# EAGLE schematic PCB-SCH mvs (EAGLE 7.6.0)
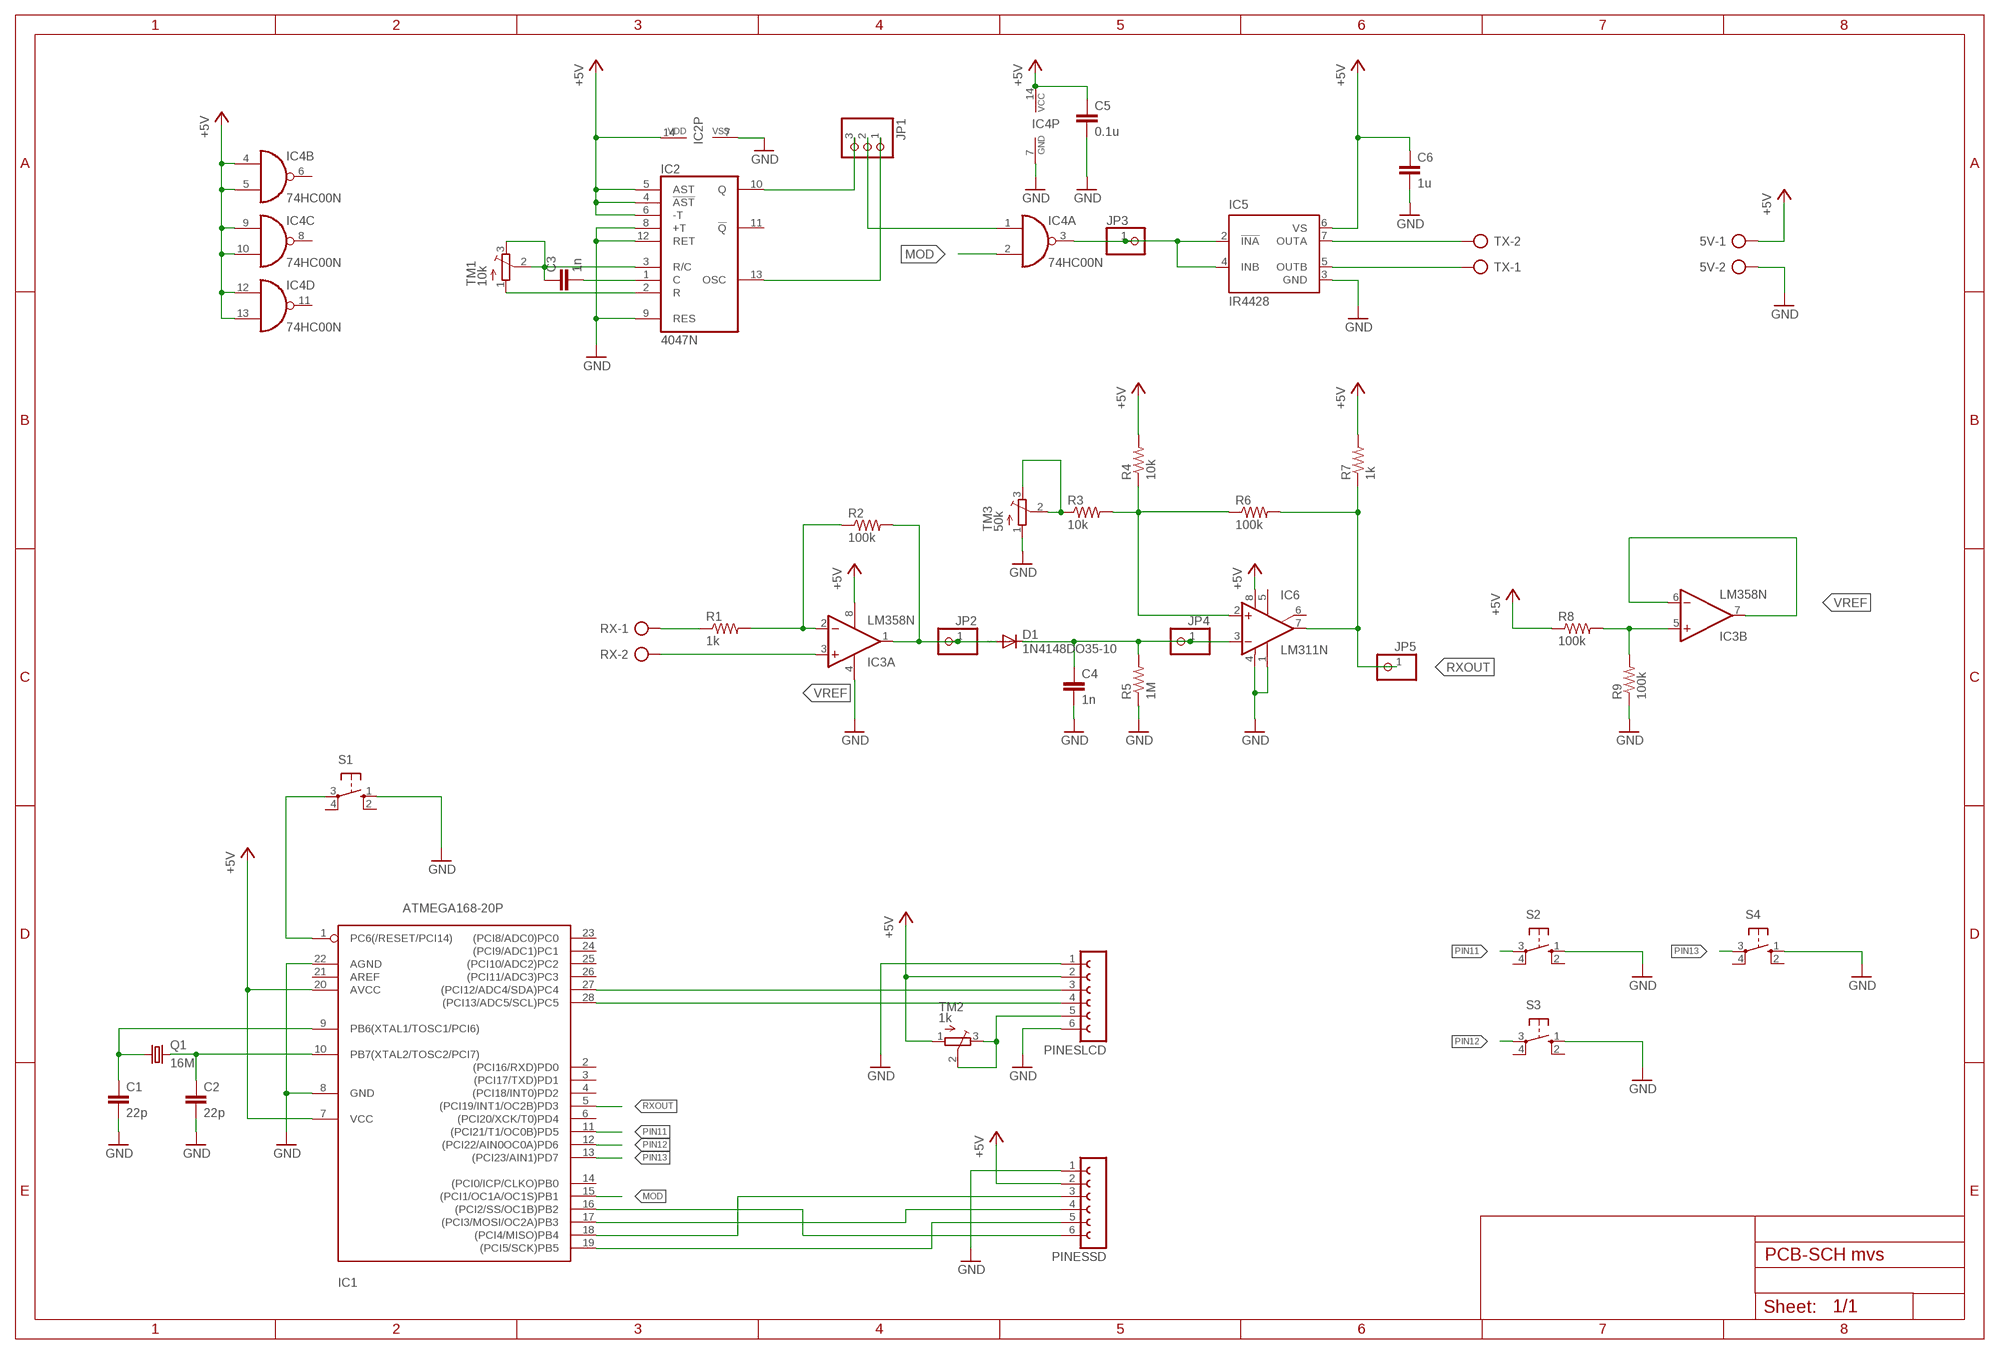
[diagram p0: schematic, sheet 1]

## Parts
5V  AK500/2  [AK500/2]
C1  22p  C-EU050-024X044  [C050-024X044]
C2  22p  C-EU050-024X044  [C050-024X044]
C3  1n  C-EU050-024X044  [C050-024X044]
C4  1n  C-EU050-024X044  [C050-024X044]
C5  0.1u  C-EU050-024X044  [C050-024X044]
C6  1u  C-EU050-024X044  [C050-024X044]
D1  1N4148DO35-10  [DO35-10]
IC1  ATMEGA168-20P  [DIL28-3]
IC2  4047N  [DIL14]
IC3  LM358N  [DIL08]
IC4  74HC00N  [DIL14]
IC5  IR4428  [DIL08]
IC6  LM311N  [DIL08]
JP1  PINHD-1X3  [1X03]
JP2  PINHD-1X1  [1X01]
JP3  PINHD-1X1  [1X01]
JP4  PINHD-1X1  [1X01]
JP5  PINHD-1X1  [1X01]
PINESLCD  FE06-1  [FE06]
PINESSD  FE06-1  [FE06]
Q1  16M  CRYSTALHC49U-V  [HC49U-V]
R1  1k  R-US_0207/10  [0207/10]
R2  100k  R-US_0207/10  [0207/10]
R3  10k  R-US_0207/10  [0207/10]
R4  10k  R-US_0207/10  [0207/10]
R5  1M  R-US_0207/10  [0207/10]
R6  100k  R-US_0207/10  [0207/10]
R7  1k  R-US_0207/10  [0207/10]
R8  100k  R-US_0207/10  [0207/10]
R9  100k  R-US_0207/10  [0207/10]
RX  AK500/2  [AK500/2]
S1  10-XX  [B3F-10XX]
S2  10-XX  [B3F-10XX]
S3  10-XX  [B3F-10XX]
S4  10-XX  [B3F-10XX]
TM1  10k  TRIMPOT3386  [TRIM-3386]
TM2  1k  TRIMPOT3386  [TRIM-3386]
TM3  50k  TRIMPOT3386  [TRIM-3386]
TX  AK500/2  [AK500/2]

## Nets
+5V: 5V.1 C5.1 C6.1 IC1.7(VCC) IC1.20(AVCC) IC2.4(!AST) IC2.5(AST) IC2.6(-T) IC2.14(VDD) IC3.8(P:V+) IC4.4(B:I0) IC4.5(B:I1) IC4.9(C:I0) IC4.10(C:I1) IC4.12(D:I0) IC4.13(D:I1) IC4.14(P:VCC) IC5.6(VS) IC6.8(V+) PINESLCD.2 PINESSD.2 R4.2 R7.2 R8.1 TM2.1(A)
GND: 5V.2 C1.2 C2.2 C4.2 C5.2 C6.2 IC1.8(GND) IC1.22(AGND) IC2.7(VSS) IC2.8(+T) IC2.9(RES) IC2.12(RET) IC3.4(P:V-) IC4.7(P:GND) IC5.3(GND) IC6.1(GND) IC6.4(V-) PINESLCD.1 PINESLCD.6 PINESSD.1 R5.1 R9.1 S1.1(S) S2.1(S) S3.1(S) S4.1(S) TM3.1(A)
MOD: IC1.15((PCI1/OC1A/OC1S)PB1) IC4.2(A:I1)
N$1: IC2.10(Q) JP1.3
N$2: IC2.13(OSC) JP1.1
N$3: IC4.1(A:I0) JP1.2
N$5: IC2.2(R) TM1.1(A)
N$6: IC5.7(OUTA) TX.2
N$7: IC5.5(OUTB) TX.1
N$9: R1.1 RX.1
N$10: IC3.2(A:-IN) R1.2 R2.1
N$11: C1.1 IC1.9(PB6(XTAL1/TOSC1/PCI6)) Q1.1
N$13: IC6.2(+IN) R3.2 R4.1 R6.1
N$14: C3.2 IC2.1(C)
N$15: R3.1 TM3.2(S) TM3.3(E)
N$16: C3.1 IC2.3(R/C) TM1.2(S) TM1.3(E)
N$17: C2.1 IC1.10(PB7(XTAL2/TOSC2/PCI7)) Q1.2
N$18: IC4.3(A:O) IC5.2(!INA) IC5.4(INB) JP3.1
N$19: D1.A IC3.1(A:OUT) JP2.1 R2.2
N$20: IC3.5(B:+IN) R8.2 R9.2
N$21: IC1.17((PCI3/MOSI/OC2A)PB3) PINESSD.4
N$22: IC1.18((PCI4/MISO)PB4) PINESSD.3
N$23: IC1.1(PC6(/RESET/PCI14)) S1.3(P)
N$24: C4.1 D1.C IC6.3(-IN) JP4.1 R5.2
N$25: IC1.19((PCI5/SCK)PB5) PINESSD.5
N$26: IC1.16((PCI2/SS/OC1B)PB2) PINESSD.6
N$27: IC1.27((PCI12/ADC4/SDA)PC4) PINESLCD.3
N$28: IC1.28((PCI13/ADC5/SCL)PC5) PINESLCD.4
N$29: PINESLCD.5 TM2.2(S) TM2.3(E)
PIN11: IC1.11((PCI21/T1/OC0B)PD5) S2.3(P)
PIN12: IC1.12((PCI22/AIN0OC0A)PD6) S3.3(P)
PIN13: IC1.13((PCI23/AIN1)PD7) S4.3(P)
RXOUT: IC1.5((PCI19/INT1/OC2B)PD3) IC6.7(OUT) JP5.1 R6.2 R7.1
VREF: IC3.3(A:+IN) IC3.6(B:-IN) IC3.7(B:OUT) RX.2
Unconnected: IC1.2((PCI16/RXD)PD0) IC1.3((PCI17/TXD)PD1) IC1.4((PCI18/INT0)PD2) IC1.6((PCI20/XCK/T0)PD4) IC1.14((PCI0/ICP/CLKO)PB0) IC1.21(AREF) IC1.23((PCI8/ADC0)PC0) IC1.24((PCI9/ADC1)PC1) IC1.25((PCI10/ADC2)PC2) IC1.26((PCI11/ADC3)PC3) IC2.11(!Q) IC4.6(B:O) IC4.8(C:O) IC4.11(D:O) IC6.5(ON) IC6.6(ON/STR) S1.2(S1) S1.4(P1) S2.2(S1) S2.4(P1) S3.2(S1) S3.4(P1) S4.2(S1) S4.4(P1)

## Library data of the parts
5V RX TX = con-ptr500:AK500/2: CONNECTOR; OC_FARNELL: unknown; OC_NEWARK: unknown
C1-C6 = rcl:C-EU: CAPACITOR, European symbol
D1 = diode:1N4148: DIODE high speed (Philips)
IC1 = adafruit:ATMEGA168*P: MICROCONTROLLER 16 kBytes FLASH 1 kBytes SRAM 512 Bytes EEPROM USART 8-channel 10 bit ADC
IC2 = 40xx:4047: LP monostable/astable MULTIVIBRATOR
IC3 = linear:LM358: OP AMP also LM158; LM258; LM2904 Source: http://cache.national.com/ds/LM/LM158.pdf
IC4 = 74xx-eu:74*00: Quad 2-input NAND gate
IC5 = ir:IR4428: DUAL LOW SIDE DRIVER Source: ID4426.pdf; MF: INTERNATIONAL RECTIFIER(IR); MPN: IR4428PBF; OC_FARNELL: 1023268; OC_NEWARK: 19K8464
IC6 = linear:LM311: COMPARATOR
JP1 = pinhead:PINHD-1X3: PIN HEADER
JP2-JP5 = adafruit:PINHD-1X1: Pin header 1x1 for 0.1" spacing With round pins
PINESLCD PINESSD = con-lsta:FE06-1: FEMALE HEADER; OC_FARNELL: unknown; OC_NEWARK: unknown
Q1 = crystal:CRYSTAL: CRYSTAL; OC_FARNELL: 1666969; OC_NEWARK: unknown
R1-R9 = rcl:R-US_: RESISTOR, American symbol
S1-S4 = switch-omron:10-XX: OMRON SWITCH; MPN: B3F-1000; OC_FARNELL: 176432; OC_NEWARK: 36M3542
TM1-TM3 = adafruit:TRIMPOT: SMT trimmer potentiometer part number TC33X http://www.ladyada.net/library/eagle